# Altium schematic sheet Sheet2.SchDoc
size A4
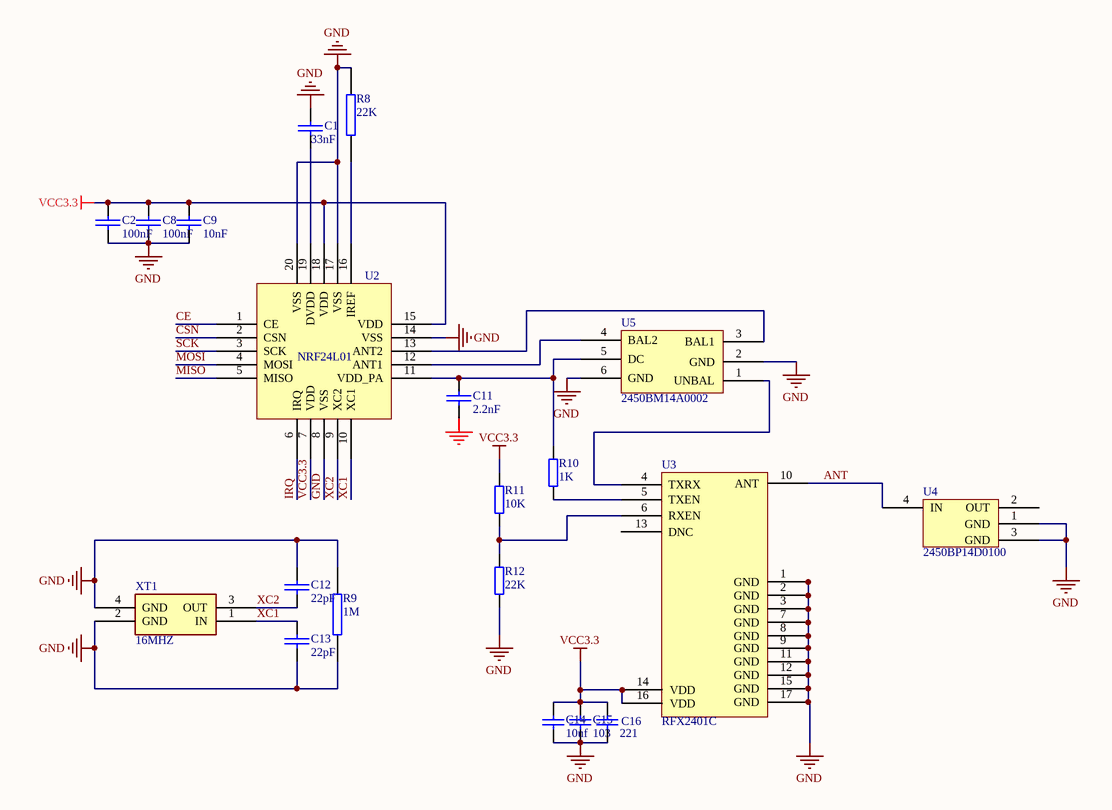
[diagram p0: Sheet2.SchDoc]

## Parts
C1  33nF  [0603]
C2  100nF  [0603]
C8  100nF  [0603]
C9  10nF  [0603]
C11  2.2nF  [0603]
C12  22pF  [0603]
C13  22pF  [0603]
C14  10uf
C15  103
C16  221
R8  22K  [0603]
R9  1M  [0603]
R10  1K
R11  10K
R12  22K
U2  NRF24L01  [nRF24l01]
U3  RFX2401C
U4  2450BP14D0100
U5  2450BM14A0002
XT1  16MHZ

## Nets
GND: C1.1 C2.2 C8.2 C9.2 C11.2 C12.2 C13.1 C14.2 C15.2 C16.2 R8.2 R9.1 R9.2 R12.1 U2.8(VSS) U2.14(VSS) U2.17(VSS) U2.20(VSS) U3.1(GND) U3.2(GND) U3.3(GND) U3.7(GND) U3.8(GND) U3.9(GND) U3.11(GND) U3.12(GND) U3.15(GND) U3.17(GND) U4.1(GND) U4.3(GND) U5.2(GND) U5.6(GND) XT1.2(GND) XT1.4(GND)
VCC3.3: C2.1 C8.1 C9.1 C14.1 C15.1 C16.1 R11.2 U2.7(VDD) U2.15(VDD) U2.18(VDD) U3.14(VDD) U3.16(VDD)
ANT: U3.10(ANT) U4.4(IN)
CE: U2.1(CE)
CSN: U2.2(CSN)
IRQ: U2.6(IRQ)
MISO: U2.5(MISO)
MOSI: U2.4(MOSI)
SCK: U2.3(SCK)
XC1: C13.2 U2.10(XC1) XT1.1(IN)
XC2: C12.1 U2.9(XC2) XT1.3(OUT)
NetC1_2: C1.2 U2.19(DVDD)
NetC11_1: C11.1 R10.2 U2.11(VDD_PA) U5.5(DC)
NetR8_1: R8.1 U2.16(IREF)
NetR10_1: R10.1 U3.5(TXEN)
NetR11_1: R11.1 R12.2 U3.6(RXEN)
NetU2_12: U2.12(ANT1) U5.4(BAL2)
NetU2_13: U2.13(ANT2) U5.3(BAL1)
NetU3_4: U3.4(TXRX) U5.1(UNBAL)

Not connected (* = marked no-connect by the designer): U3 13(DNC); U4 2(OUT)

## Library data of the parts
C1 C2 C8 C9 C11-C13 = CAP: Capacitor
C14-C16 = CAP-SMD
R8 R9 = RES2
R10-R12 = RES-SMD
XT1 = CRYSTAL-L